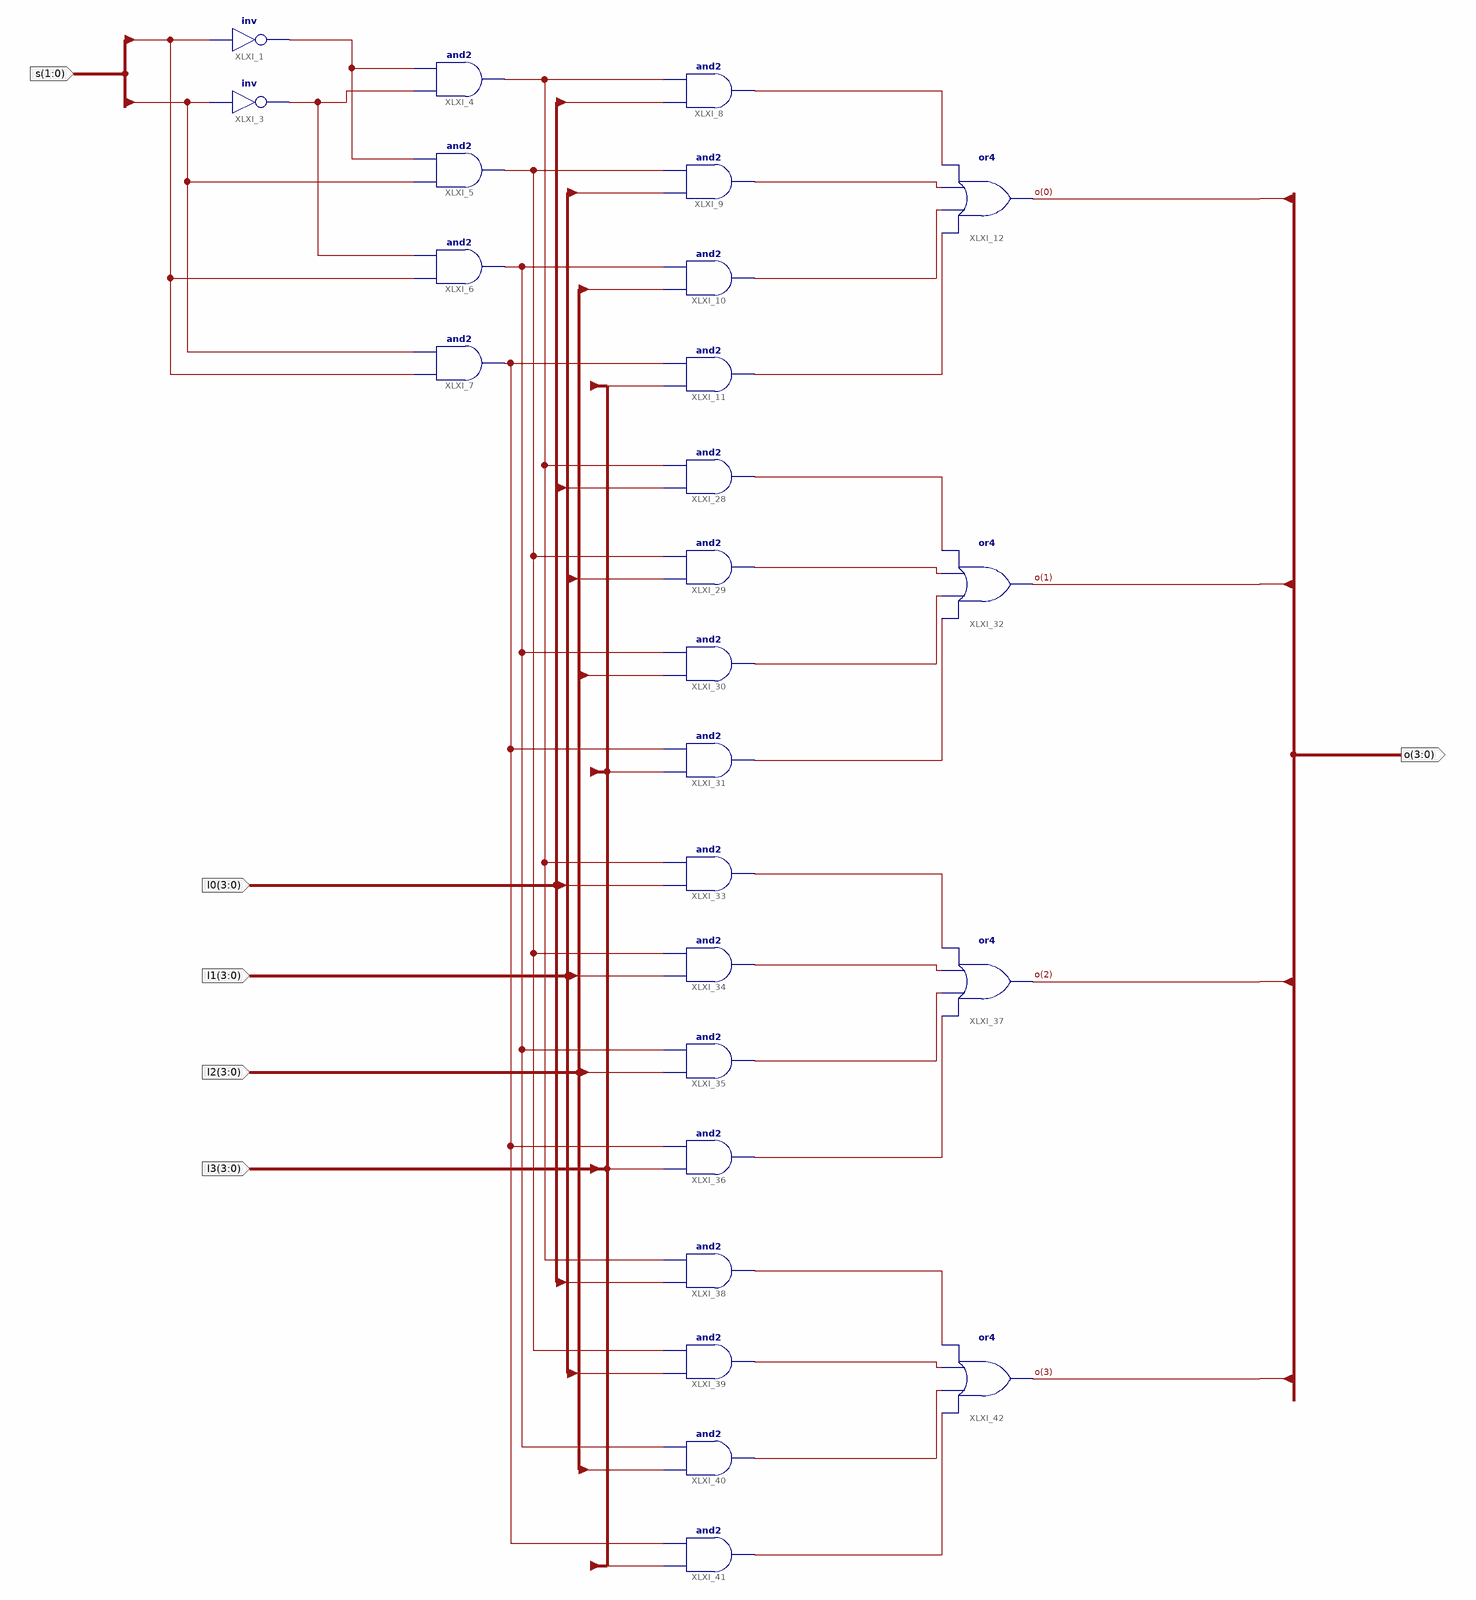
[diagram p0: schematic sheet 1]
// Xilinx ISE schematic MUX4T1_4_sch.sch (kintex7) as structural Verilog: 26 symbols, 6 ports
module MUX4T1_4_sch (
  input  [1:0] s,
  input  [3:0] I0,
  input  [3:0] I1,
  input  [3:0] I2,
  input  [3:0] I3,
  output [3:0] o
);

  wire XLXN_7, XLXN_8, XLXN_9, XLXN_10, XLXN_16, XLXN_18, XLXN_41, XLXN_42, XLXN_43, XLXN_44, XLXN_46,
       XLXN_47, XLXN_48, XLXN_49, XLXN_51, XLXN_52, XLXN_53, XLXN_54, XLXN_57, XLXN_58, XLXN_61, XLXN_63;

  not XLXI_1 (XLXN_16, s[1]);
  not XLXI_3 (XLXN_18, s[0]);
  and XLXI_4 (XLXN_63, XLXN_18, XLXN_16);
  and XLXI_5 (XLXN_61, s[0], XLXN_16);
  and XLXI_6 (XLXN_58, s[1], XLXN_18);
  and XLXI_7 (XLXN_57, s[1], s[0]);
  and XLXI_8 (XLXN_7, I0[0], XLXN_63);
  and XLXI_9 (XLXN_8, I1[0], XLXN_61);
  and XLXI_10 (XLXN_9, I2[0], XLXN_58);
  and XLXI_11 (XLXN_10, I3[0], XLXN_57);
  or XLXI_12 (o[0], XLXN_10, XLXN_9, XLXN_8, XLXN_7);
  and XLXI_28 (XLXN_41, I0[1], XLXN_63);
  and XLXI_29 (XLXN_42, I1[1], XLXN_61);
  and XLXI_30 (XLXN_43, I2[1], XLXN_58);
  and XLXI_31 (XLXN_44, I3[1], XLXN_57);
  or XLXI_32 (o[1], XLXN_44, XLXN_43, XLXN_42, XLXN_41);
  and XLXI_33 (XLXN_46, I0[2], XLXN_63);
  and XLXI_34 (XLXN_47, I1[2], XLXN_61);
  and XLXI_35 (XLXN_48, I2[2], XLXN_58);
  and XLXI_36 (XLXN_49, I3[2], XLXN_57);
  or XLXI_37 (o[2], XLXN_49, XLXN_48, XLXN_47, XLXN_46);
  and XLXI_38 (XLXN_51, I0[3], XLXN_63);
  and XLXI_39 (XLXN_52, I1[3], XLXN_61);
  and XLXI_40 (XLXN_53, I2[3], XLXN_58);
  and XLXI_41 (XLXN_54, I3[3], XLXN_57);
  or XLXI_42 (o[3], XLXN_54, XLXN_53, XLXN_52, XLXN_51);
endmodule
